# EasyEDA schematic Schematic_Lithium-wemos-shield.json
TITLE: Lithium wemos shield; REV: 1.3; Date: 2022-01-31; Sheet: 1/1; Drawn By: drkoster; Company: Your Company
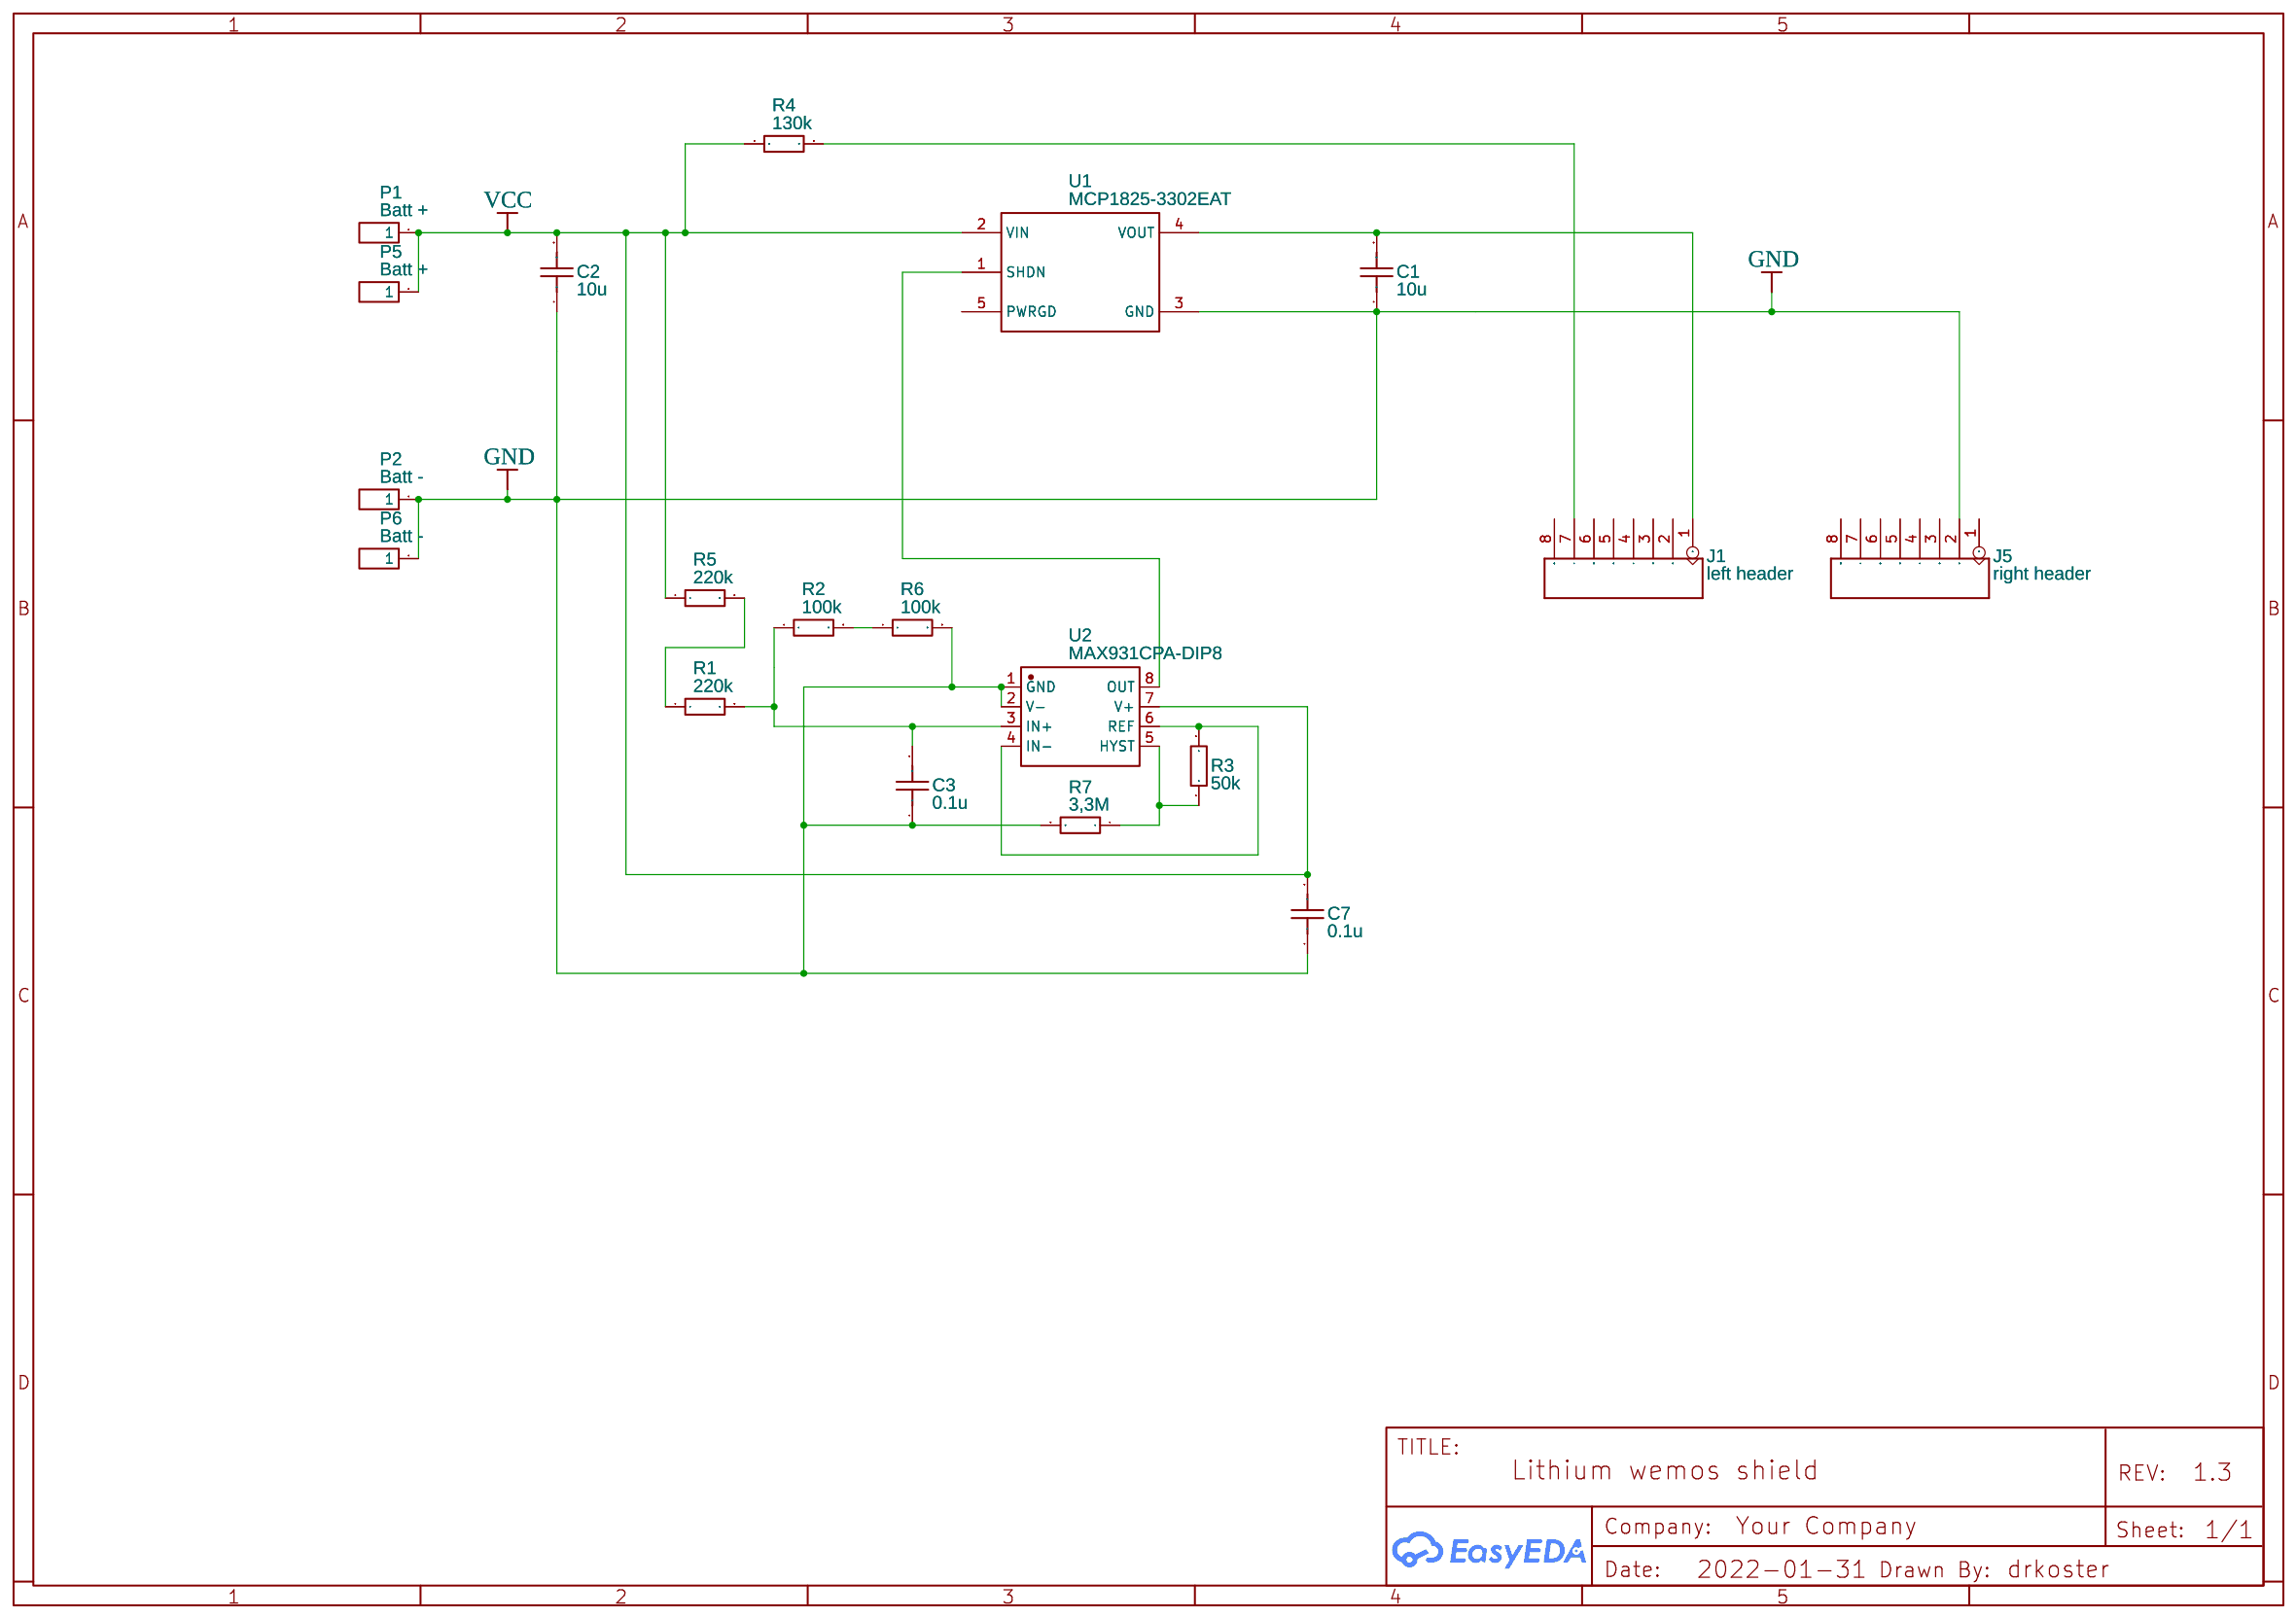
[diagram p0: schematic sheet]

## Parts
C1  10u  [RAD-0.1]
C2  10u  [RAD-0.1]
C3  0.1u  [RAD-0.1]
C7  0.1u  [RAD-0.1]
J1  left header  [H8-2.54]
J5  right header  [H8-2.54]
P1  Batt +  [HDR-1X1/2.54]
P2  Batt -  [HDR-1X1/2.54]
P5  Batt +  [HDR-1X1/2.54]
P6  Batt -  [HDR-1X1/2.54]
R1  220k  [R_AXIAL-0.3]
R2  100k  [R_AXIAL-0.3]
R3  50k  [R_AXIAL-0.3]
R4  130k  [R_AXIAL-0.3]
R5  220k  [R_AXIAL-0.3]
R6  100k  [R_AXIAL-0.3]
R7  3,3M  [R_AXIAL-0.3]
U1  MCP1825-3302EAT  [TO-220-AT5]
U2  MAX931CPA-DIP8  [MAX931CPA]

## Library data of the parts
C1-C3 C7 = Cap_RAD-0.1_US: Manufacturer Part: ?
J1 J5 = -: DIP Long Black Female Header VERT;; Manufacturer Part: F185-1108A0BSYA5
P1 P2 P5 P6 = -: Supplier: LCSC; Manufacturer: ReliaPro; Manufacturer Part: Header-Male-2.54_1x1; Supplier Part: C81276
R1-R7 = MF1W-5.1Ω±1%: Supplier: LCSC; Manufacturer: CCO; Supplier Part: C127239
U1 = MCP1825-3302EAT: 500 mA, Low Voltage, Low Quiescent Current LDO Regulator, 5-Pin TO-220, Extended Temperature
U2 = MAX931CPA-DIP8: Manufacturer: MAXIM; Supplier: Mouser; Supplier Part: 700-MAX931CPA; link: https://www.onsemi.com/pub/Collateral/FOD814-D.PDF; Contributor: ASNMLT

## Nets
GND: C1.1 C2.1 C3.1 C7.1 J5.2 P2.1 P6.1 R6.2 R7.2 U1.3(GND) U2.1(GND) U2.2(V-)
VCC: C2.2 C7.2 P1.1 P5.1 R4.1 R5.1 U1.2(VIN) U2.7(V+)
Net-(C1-2): C1.2 J1.1 U1.4(VOUT)
Net-(C3-2): C3.2 R1.2 R2.1 U2.3(IN+)
Net-(J1-7): J1.7 R4.2
Net-(R1-1): R1.1 R5.2
Net-(R2-2): R2.2 R6.1
Net-(R3-1): R3.1 R7.1 U2.5(HYST)
Net-(R3-2): R3.2 U2.4(IN-) U2.6(REF)
Net-(U1-1): U1.1(SHDN) U2.8(OUT)

Not connected (* = marked no-connect by the designer): J1 2 3 4 5 6 8; J5 1 3 4 5 6 7 8; U1 5(PWRGD)
